# EAGLE schematic stroboskop (EAGLE 8.5.0)
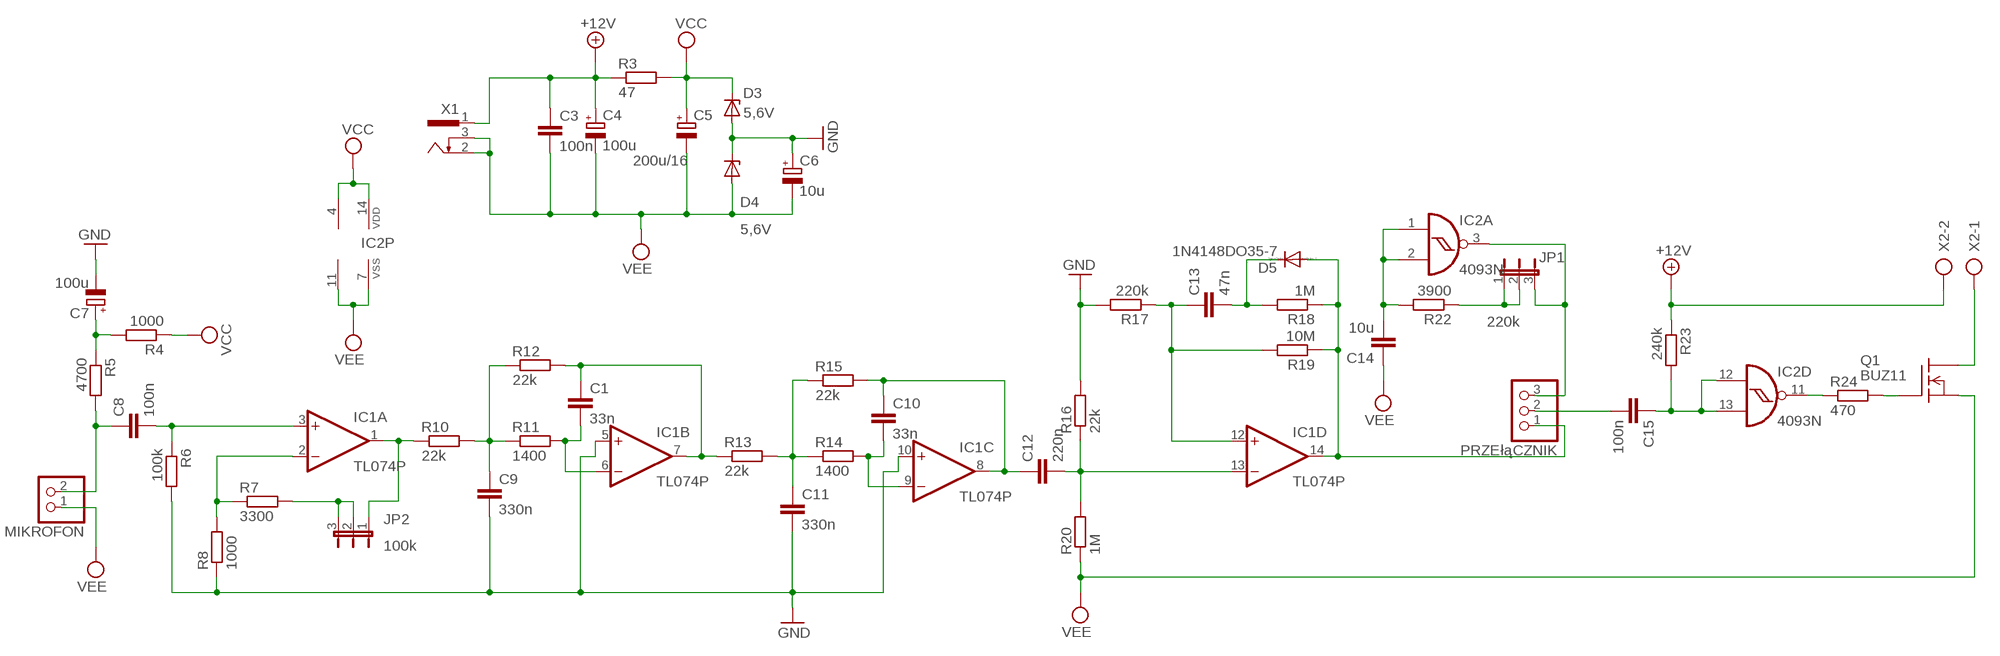
[diagram p0: schematic, sheet 1]

## Parts
C1  33n  C-EU025-025X050  [C025-025X050]
C3  100n  C-EU025-025X050  [C025-025X050]
C4  100u  CPOL-EUE2,5-6E  [E2,5-6E]
C5  200u/16  CPOL-EUE2,5-6E  [E2,5-6E]
C6  10u  CPOL-EUE2,5-6E  [E2,5-6E]
C7  100u  CPOL-EUE2,5-6E  [E2,5-6E]
C8  100n  C-EU025-025X050  [C025-025X050]
C9  330n  C-EU025-025X050  [C025-025X050]
C10  33n  C-EU025-025X050  [C025-025X050]
C11  330n  C-EU025-025X050  [C025-025X050]
C12  220n  C-EU025-025X050  [C025-025X050]
C13  47n  C-EU025-025X050  [C025-025X050]
C14  10u  C-EU025-025X050  [C025-025X050]
C15  100n  C-EU025-025X050  [C025-025X050]
D3  5,6V  1N821  [DO35Z10]
D4  5,6V  1N821  [DO35Z10]
D5  1N4148DO35-7  [DO35-7]
IC1  TL074P  [DIL14]
IC2  4093N  [DIL14]
JP1  220k  JP2E  [JP2]
JP2  100k  JP2E  [JP2]
MIKROFON  PINHD-1X2  [1X02]
PRZEłąCZNIK  PINHD-1X3  [1X03]
Q1  BUZ11  [TO220]
R3  47  R-EU_0204/5  [0204/5]
R4  1000  R-EU_0204/5  [0204/5]
R5  4700  R-EU_0204/5  [0204/5]
R6  100k  R-EU_0204/5  [0204/5]
R7  3300  R-EU_0204/5  [0204/5]
R8  1000  R-EU_0204/5  [0204/5]
R10  22k  R-EU_0204/5  [0204/5]
R11  1400  R-EU_0204/5  [0204/5]
R12  22k  R-EU_0204/5  [0204/5]
R13  22k  R-EU_0204/5  [0204/5]
R14  1400  R-EU_0204/5  [0204/5]
R15  22k  R-EU_0204/5  [0204/5]
R16  22k  R-EU_0204/5  [0204/5]
R17  220k  R-EU_0204/5  [0204/5]
R18  1M  R-EU_0204/5  [0204/5]
R19  10M  R-EU_0204/5  [0204/5]
R20  1M  R-EU_0204/5  [0204/5]
R22  3900  R-EU_0204/5  [0204/5]
R23  240k  R-EU_0204/5  [0204/5]
R24  470  R-EU_0204/5  [0204/5]
X1  733980-62  [733980-62]
X2  AK300/2  [AK300/2]

## Nets
+12V: C3.1 C4.+ R3.1 R23.1 X1.1 X2.2
GND: C6.+ C7.- C9.2 C11.2 D3.A D4.C IC1.5(B:+IN) IC1.10(C:+IN) R6.2 R8.1 R16.2 R17.2
N$1: C7.+ R4.2 R5.1
N$2: C8.1 MIKROFON.2 R5.2
N$3: C8.2 IC1.3(A:+IN) R6.1
N$4: C11.1 R13.2 R14.1 R15.1
N$5: IC1.2(A:-IN) R7.1 R8.2
N$6: C10.2 IC1.9(C:-IN) R14.2
N$7: JP2.2 JP2.3 R7.2
N$8: C10.1 C12.1 IC1.8(C:OUT) R15.2
N$9: IC1.1(A:OUT) JP2.1 R10.1
N$10: C9.1 R10.2 R11.1 R12.1
N$11: C1.1 IC1.7(B:OUT) R12.2 R13.1
N$12: C1.2 IC1.6(B:-IN) R11.2
N$13: C12.2 IC1.13(D:-IN) R16.1 R20.2
N$14: C15.2 PRZEłąCZNIK.2
N$15: C13.1 IC1.12(D:+IN) R17.1 R19.2
N$16: C13.2 D5.C R18.2
N$17: D5.A IC1.14(D:OUT) PRZEłąCZNIK.1 R18.1 R19.1
N$18: IC2.3(A:O) JP1.3 PRZEłąCZNIK.3
N$19: C15.1 IC2.12(D:I0) IC2.13(D:I1) R23.2
N$21: C14.2 IC2.1(A:I0) IC2.2(A:I1) R22.2
N$22: IC2.11(D:O) R24.1
N$23: JP1.1 JP1.2 R22.1
N$25: Q1.1(G) R24.2
N$26: Q1.2(D) X2.1
VCC: C5.+ D3.C IC1.4(P:V+) IC2.14(P:VDD) R3.2 R4.1
VEE: C3.2 C4.- C5.- C6.- C14.1 D4.A IC1.11(P:V-) IC2.7(P:VSS) MIKROFON.1 Q1.3(S) R20.1 X1.2 X1.3
Unconnected: IC2.4(B:O) IC2.5(B:I0) IC2.6(B:I1) IC2.8(C:I0) IC2.9(C:I1) IC2.10(C:O)

## Library data of the parts
C1 C3 C8-C15 = rcl:C-EU: CAPACITOR, European symbol
C4-C7 = rcl:CPOL-EU: POLARIZED CAPACITOR, European symbol
D3 D4 = diode:1N821: Reference DIODE temperature compensated, 6,2 V
D5 = diode:1N4148: DIODE high speed (Philips)
IC1 = linear:TL074: OP AMP
IC2 = 40xx:4093: Quad 2-input NAND schmitt trigger
JP1 JP2 = jumper:JP2E: JUMPER
MIKROFON = pinhead:PINHD-1X2: PIN HEADER
PRZEłąCZNIK = pinhead:PINHD-1X3: PIN HEADER
Q1 = transistor-fet:BUZ11: N-Channel Enhancement MOSFET 50V; 30A; 0,040Ohm
R3-R8 R10-R20 R22-R24 = rcl:R-EU_: RESISTOR, European symbol
X1 = con-conrad:73398?: FEMALE PRINT CONNECTOR Niedervolt-Steckverbinder Distributor Conrad
X2 = con-ptr500:AK300/2: CONNECTOR; OC_FARNELL: unknown; OC_NEWARK: unknown

## Net classes
0 default: clearance 0.205 mm